# Altium schematic sheet Ports.SchDoc
size A; SheetNumber: 3; SheetTotal: 3
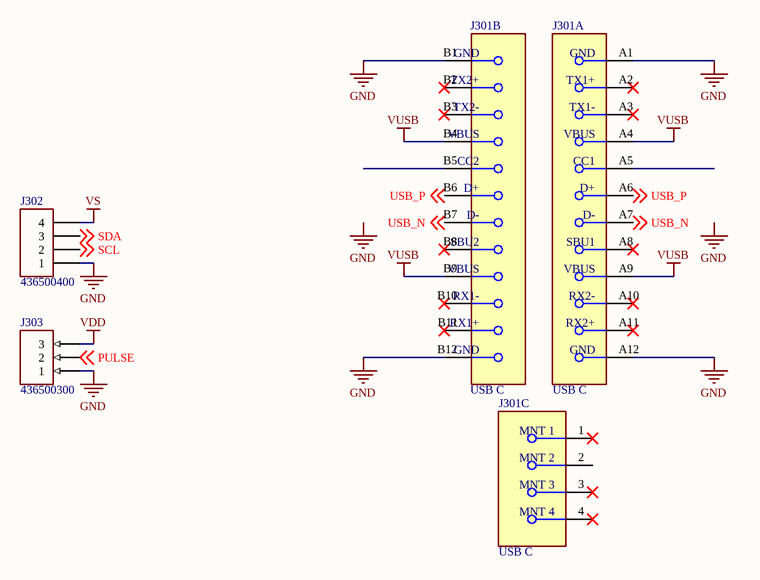
[diagram p0: Ports.SchDoc]

## Parts
J301  USB C  [FP-1054500101-MFG]  (parts A,B,C of 3)
J302  436500400  [436500400]
J303  436500300  [436500300]

## Nets
GND: J301.A1(GND) J301.A12(GND) J301.B1(GND) J301.B12(GND) J302.1 J303.1
VDD: J303.3
VS: J302.4
VUSB: J301.A4(VBUS) J301.A9(VBUS) J301.B4(VBUS) J301.B9(VBUS)
PULSE: J303.2 ; off-sheet PULSE
SCL: J302.2 ; off-sheet SCL
SDA: J302.3 ; off-sheet SDA
USB_N: J301.A7(D-) J301.B7(D-) ; off-sheet USB_N
USB_P: J301.A6(D+) J301.B6(D+) ; off-sheet USB_P

Not connected (* = marked no-connect by the designer): J301 1(MNT_1)* 2(MNT_2) 3(MNT_3)* 4(MNT_4)* A2(TX1+)* A3(TX1-)* A5(CC1) A8(SBU1)* A10(RX2-)* A11(RX2+)* B2(TX2+)* B3(TX2-)* B5(CC2) B8(SBU2)* B10(RX1-)* B11(RX1+)*

## Notes on the sheet
- Labels drawn without touching a wire or pin: GND

## Library data of the parts
J301 = 1054500101: CONN RCP USB3.1 TYPEC 24P SMD RA; Manufacturer: Molex; Number Of Contacts: 24; Voltage Rating: 30V; Shielding: true; Is Female: yes; Current Rating: 0.25/1.25/5A; Pitch: 0.5mm; Conn Orientation: Right Angle; Package: 0; Height: 3.44mm; Footprint Url: https://www.molex.com/pdm_docs/sd/1054500101_sd.pdf; Device Class L1: Connectors; Category: Conn; Device Class L2: USB Connectors; Digikey Description: CONN RCP USB3.1 TYPEC 24P SMD RA; Contact Material: Gold,Nickel; Mouser Description: USB Shielded I/O Receptacle; Type C; Right Angle; Surface Mount; Gold over Nickel; ComponentLink2Description: Datasheet; Lead Free: Yes; Automotive: No; Temperature Range High: +85°C; RoHS: TRUE; Octopart: https://octopart.com/105450-0101-molex-68082325; ComponentLink2URL: https://www.molex.com/webdocs/datasheets/pdf/en-us/1054500101_IO_CONNECTORS.pdf; Temperature: -30°C to +85°C; Usb Standard: USB 3.1; Temperature Range Low: -30°C; Device Class L3: unset; Manufacturer Part Number: 1054500101; Supplier 1: Digi-Key; Supplier Part Number 1: WM12856CT-ND
J302 = 436500400: Supplier 1: Digi-Key; Supplier Part Number 1: WM1862-ND
J303 = 436500300: Supplier 1: Digi-Key; Supplier Part Number 1: WM1861-ND